# Altium schematic sheet Умножитель.SchDoc: Интерфейсный модуль ФЭУ-102
size A3; Address1: (с) Быканов Андрей; Address2: г.Тула 2016г.; Revision: 1.3
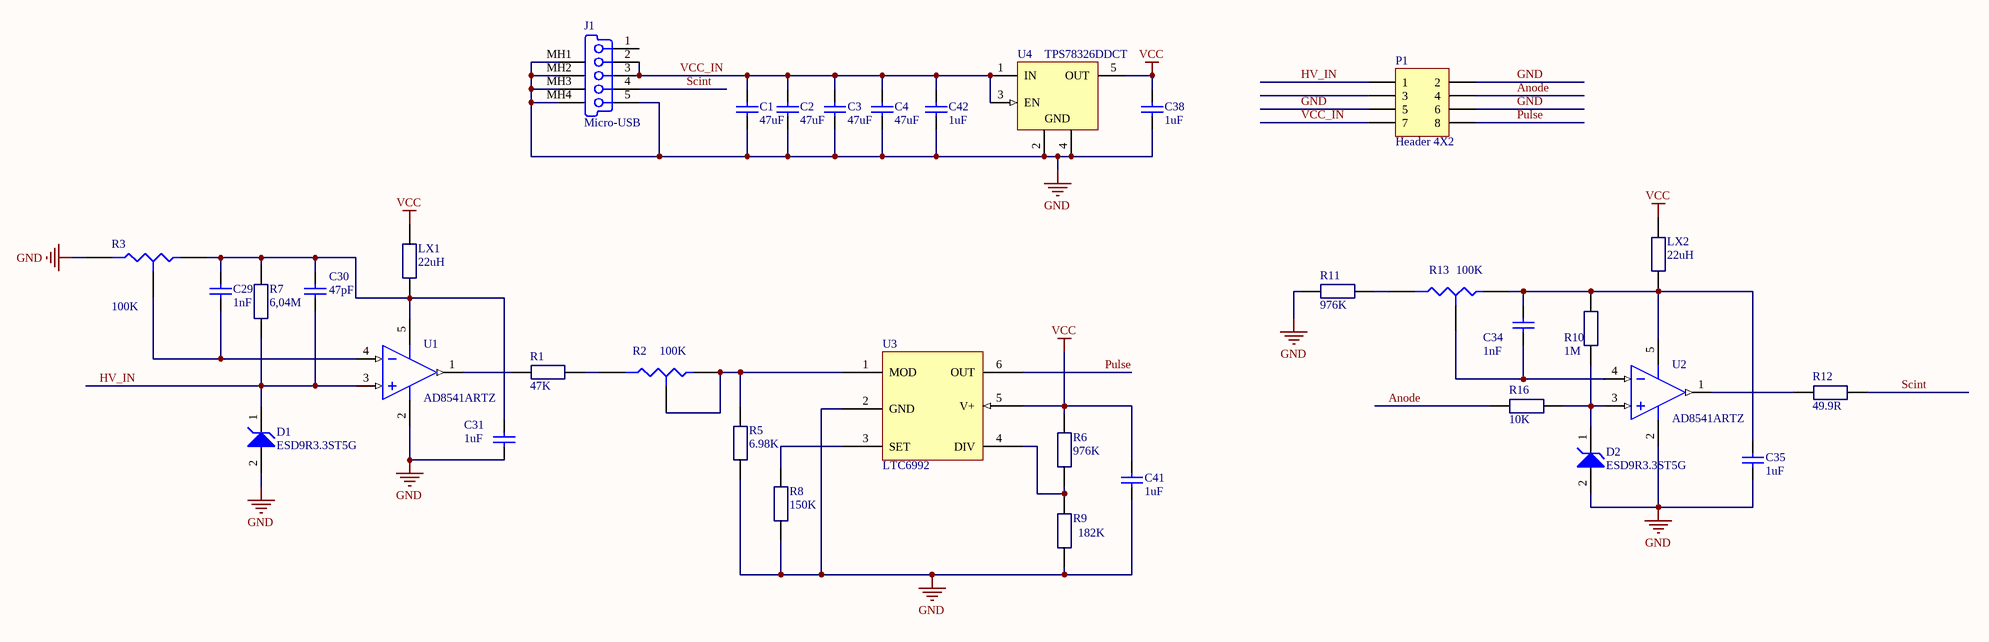
[diagram p0: Умножитель.SchDoc]

## Parts
C1  47uF  [C1206]
C2  47uF  [C1206]
C3  47uF  [C1206]
C4  47uF  [C1206]
C29  1nF  [1608[0603]_CAP]
C30  47pF  [1608[0603]_CAP]
C31  1uF  [1608[0603]_CAP]
C34  1nF  [1608[0603]_CAP]
C35  1uF  [1608[0603]_CAP]
C38  1uF  [1608[0603]_CAP]
C41  1uF  [1608[0603]_CAP]
C42  1uF  [1608[0603]_CAP]
D1  ESD9R3.3ST5G  [ONSC-SOD-923-2-514AB-01_V]
D2  ESD9R3.3ST5G  [ONSC-SOD-923-2-514AB-01_V]
J1  Micro-USB  [47346-0001]
LX1  22uH  [Resistor]
LX2  22uH  [Resistor]
P1  Header 4X2  [PLS_FLAT_CONN]
R1  47K  [1608[0603]]
R2  100K  [3223W]
R3  100K  [3223W]
R5  6.98K  [1608[0603]]
R6  976K  [1608[0603]]
R7  6,04M  [1608[0603]]
R8  150K  [1608[0603]]
R9  182K  [1608[0603]]
R10  1M  [1608[0603]]
R11  976K  [1608[0603]]
R12  49.9R  [1608[0603]]
R13  100K  [3223W]
R16  10K  [1608[0603]]
U1  AD8541ARTZ  [ADI-RJ-5_N]
U2  AD8541ARTZ  [ADI-RJ-5_N]
U3  LTC6992  [SOT23-6L]
U4  TPS78326DDCT  [TI-DDC5_N]

## Nets
GND: C1.2 C2.2 C3.2 C4.2 C31.2 C35.2 C38.1 C41.2 C42.2 D1.2(A) D2.2(A) J1.5(GND) J1.MH1(Tab) J1.MH2(Tab) J1.MH3(Tab) J1.MH4(Tab) P1.2 P1.5 P1.6 R3.2(B) R5.2 R8.2 R9.2 R11.1(A) U1.2(-V) U2.2(-V) U3.2(GND) U4.2(GND) U4.4(GND)
VCC: C38.2 C41.1 LX1.1(A) LX2.1(A) R6.1(A) U3.5(V+) U4.5(OUT)
Anode: P1.4 R16.1(A)
HV_IN: C30.2 D1.1(K) P1.1 R7.2 U1.3(+IN_A)
Pulse: P1.8 U3.6(OUT)
Scint: J1.4(NC) R12.1(A)
VCC_IN: C1.1 C2.1 C3.1 C4.1 C42.1 J1.2(D-) J1.3(D+) P1.7 U4.1(IN) U4.3(EN)
NetC29_1: C29.1 C30.1 C31.1 LX1.2 R3.1(A) R7.1(A) U1.5(+V)
NetC29_2: C29.2 R3.3(TAP) U1.4(-IN_A)
NetC34_1: C34.1 C35.1 LX2.2 R10.2 R13.1(A) U2.5(+V)
NetC34_2: C34.2 R13.3(TAP) U2.4(-IN_A)
NetD2_1: D2.1(K) R10.1(A) R16.2 U2.3(+IN_A)
NetR1_1: R1.1(A) R2.2(B)
NetR1_2: R1.2 U1.1(OUT_A)
NetR2_1: R2.1(A) R2.3(TAP) R5.1(A) U3.1(MOD)
NetR6_2: R6.2 R9.1(A) U3.4(DIV)
NetR8_1: R8.1(A) U3.3(SET)
NetR11_2: R11.2 R13.2(B)
NetR12_2: R12.2 U2.1(OUT_A)

Not connected (* = marked no-connect by the designer): J1 1(V_BUS_(5V)); P1 3

## Notes on the sheet
- Title
- Size:
- Date:
- A3
- Number:
- Time:
- Revision:
- Sheet
- of
- File:

## Library data of the parts
C1-C4 = Cap Semi: Capacitor (Semiconductor SIM Model); Order: GRM31CR60J476ME19L; Published: 8-Jun-2000; LatestRevisionDate: 29-May-2009; LatestRevisionNote: IPC-7351 Footprint Added.; PackageReference: C0402; Publisher: Altium Limited; PackageDescription: Chip Capacitor; Value: 47uF
C29 C34 = Cap Semi: Capacitor (Semiconductor SIM Model); Order: CC0603JRNPO9BN102; Published: 8-Jun-2000; LatestRevisionDate: 29-May-2009; LatestRevisionNote: IPC-7351 Footprint Added.; PackageReference: C0402; Publisher: Altium Limited; PackageDescription: Chip Capacitor; Value: 1nF
C30 = Cap Semi: Capacitor (Semiconductor SIM Model); Order: CC0603JRNPOABN470; Published: 8-Jun-2000; LatestRevisionDate: 29-May-2009; LatestRevisionNote: IPC-7351 Footprint Added.; PackageReference: C0402; Publisher: Altium Limited; PackageDescription: Chip Capacitor; Value: 47pF
C31 C35 C38 C41 C42 = Cap Semi: Capacitor (Semiconductor SIM Model); Order: CC0603KRX5R7BB105; Published: 8-Jun-2000; LatestRevisionDate: 29-May-2009; LatestRevisionNote: IPC-7351 Footprint Added.; Publisher: Altium Limited; PackageDescription: Chip Capacitor; Value: 1uF
  C31 C35: PackageReference: C1206
  C38 C41 C42: PackageReference: C0402
D1 D2 = ESD9R3.3ST5G: Transient Voltage Suppressor, ESD Protection Diode with Ultra-Low Leakage, 2-Pin SOD-923, Pb-Free, Tape and Reel; Manufacturer: On Semiconductor; C Max (pF): 0.9; Direction: Unidirectional; IR Max (uA): 0.001; Number of Lines: 1; V(BR) Min (V): 4.8; VRWM Max (V): 3.3; DatasheetVersion: Rev. 1; PackageVersion: Rev. C, 03/2011; PackageReference: SOD-923-2-514AB-01; PackageDescription: 2-Pin SOD, Body 0.8 x 0.6 mm; Supplier 1: Digi-Key; Supplier Part Number 1: ESD9R3.3ST5GOSTR-ND; Supplier 2: Digi-Key; Supplier Part Number 2: ESD9R3.3ST5GOSCT-ND; Supplier 3: Digi-Key; Supplier Part Number 3: ESD9R3.3ST5GOSDKR-ND; Supplier 4: Farnell; Supplier Part Number 4: 2101835; Supplier 5: Mouser; Supplier Part Number 5: 863-ESD9R3.3ST5G; Packing: Tape and Reel; RoHS: Pb-Free; Mounting Technology: Surface Mount; PartNumber: ESD9R3.3ST5G; ComponentLink1Description: Manufacturer URL; ComponentLink1URL: http://www.onsemi.com/; ComponentLink2Description: Datasheet; ComponentLink2URL: http://www.onsemi.com/pub_link/Collateral/ESD9R3.3S-D.PDF; ComponentLink3Description: Package Specification; ComponentLink3URL: http://www.onsemi.com/pub_link/Collateral/514AB.PDF
J1 = 0481900001: USB On-The-Go (OTG) Mini-B Receptacle, Right Angle, SMT, 0.80mm (.031") Pitch, Solder Tabs with Back Cover, Recessed Type; Order: Molex 47346-0001
LX1 LX2 = Resistor 0805: Order: LQM21FN220N00L; Value: 22uH
P1 = Header 4X2: Header, 4-Pin, Dual row; LatestRevisionDate: 17-Jul-2002; LatestRevisionNote: Re-released for DXP Platform.; Publisher: Altium Limited
R1 = Resistor 0805: Order: RC0603FR-0747KL; Value: 47K
R2 R3 R13 = Res Tap: Tapped Resistor; Sim Note: Enter the Resistance value and the set point into parameter fields.; Set Position: 0.5; Order: 3223W-1-104E; Published: 24-Mar-1999; LatestRevisionDate: 17-Jul-2002; LatestRevisionNote: Re-released for DXP Platform.; PackageReference: VR3; Publisher: Altium Limited; PackageDescription: Variable Resistor, Thru-Hole; 3 Leads; Value: 100K
R5 = Resistor 0805: Order: RC0603FR-076K98L; Value: 6.98K
R6 R11 = Resistor 0805: Order: RC0603FR-07976KL; Value: 976K
R7 = Resistor 0805: Order: CRCW06036M04FKEA; Value: 6,04M
R8 = Resistor 0805: Order: RC0603FR-07150KL; Value: 150K
R9 = Resistor 0805: Order: RC0805FR-07182KL; Value: 182K
R10 = Resistor 0805: Order: RC0603FR-071ML; Value: 1M
R12 = Resistor 0805: Order: RC0603FR-0749R9L; Value: 49.9R
R16 = Resistor 0805: Order: RC0603FR-1010KL; Value: 10K
U1 U2 = AD8541ARTZ-R2: Single Channel RRIO Operational Amplifier, 1 MHz BW, 920 mV/us SR, Industrial, 5-pin SOT23 (RJ-5), Reel; Generic Part Number: AD8541; Manufacturer: Analog Devices; Amplifiers Per Package: 1; Input Bias Current: 4pA; Input Offset Voltage: 1mV; Iq/Amp: 65uA; Small Signal Bandwidth: 1MHz; V Span Max: 5.5V; V Span Min: 2.7V; DatasheetVersion: Rev. G; PackageVersion: 121608-A; PackageReference: RJ-5; PackageDescription: 5-Pin Small Outline Transistor Package, Body 2.9 x 1.6 mm, Pitch 0.95 mm; Supplier 1: Digi-Key; Supplier Part Number 1: AD8541ARTZ-R2TR-ND; Supplier 2: Digi-Key; Supplier Part Number 2: AD8541ARTZ-R2CT-ND; Supplier 3: Digi-Key; Supplier Part Number 3: AD8541ARTZ-R2DKR-ND; Supplier 4: Farnell; Supplier Part Number 4: 1837434; Supplier 5: Newark; Supplier Part Number 5: 59K6820; Slew Rate: 920mV/us; Mounting Technology: Surface Mount; Code_JEDEC: MO-178-AA; PartNumber: AD8541ARTZ-R2; ComponentLink1Description: Manufacturer URL; ComponentLink1URL: http://www.analog.com/en/index.html; ComponentLink2Description: Datasheet; ComponentLink2URL: http://www.analog.com/static/imported-files/data_sheets/AD8541_8542_8544.pdf; ComponentLink3Description: Package Specification; ComponentLink3URL: http://www.analog.com/static/imported-files/packages/PKG_PDF/SOT-23(RJ)/RJ_5.pdf; ComponentLink4Description: Reference Circuit; ComponentLink4URL: http://www.analog.com/en/all-operational-amplifiers-op-amps/operational-amplifiers-op-amps/ad8541/products/product.html#product-recommendations; Order: AD8541ARTZ
U4 = TPS78330DDCR: Single Output LDO, 150 mA, Fixed 3 V Output, 2.2 to 5.5 V Input, with Ultra-Low IQ, 5-pin SOT (DDC), -40 to 105 degC, Green (RoHS & no Sb/Br); Manufacturer: Texas Instruments; Accuracy(%): 3; Iout(Max)(A): 0.15; Iq(Typ)(mA): 0.0005; Rating: Catalog; SubFamily: Single Channel LDO; Vdo(Typ)(mV): 130; Vin(Max)(V): 5.5; Vin(Min)(V): 2.2; DatasheetVersion: SBVS133; PackageVersion: 4204403-2/E; PackageReference: DDC5; PackageDescription: 5-Pin Plastic Small Outline, Body 2.9 x 1.6 mm, 0.95 mm Pitch; Supplier 1: Digi-Key; Supplier Part Number 1: 296-25880-2-ND; Supplier 2: Digi-Key; Supplier Part Number 2: 296-25880-1-ND; Supplier 3: Digi-Key; Supplier Part Number 3: 296-25880-6-ND; Supplier 4: Newark; Supplier Part Number 4: 72R6681; Supplier 5: Mouser; Supplier Part Number 5: 595-TPS78330DDCR; Eco-Plan: Green (RoHS & no Sb/Br); Fixed Output Options(V): 3; Vout Adj(Max)(V): 3; Vout Adj(Min)(V): 3; Mounting Technology: Surface Mount; Code_JEDEC: MO-193; PartNumber: TPS78326DDCT; ComponentLink1Description: Manufacturer URL; ComponentLink1URL: http://www.ti.com/; ComponentLink2Description: Datasheet; ComponentLink2URL: http://www.ti.com/general/docs/lit/getliterature.tsp?genericPartNumber=TPS78330&fileType=pdf; ComponentLink3Description: Package Specification; ComponentLink3URL: http://www.ti.com/litv/pdf/mpds123d; Order: TPS78326DDCT